# Altium project quads.PrjPCB
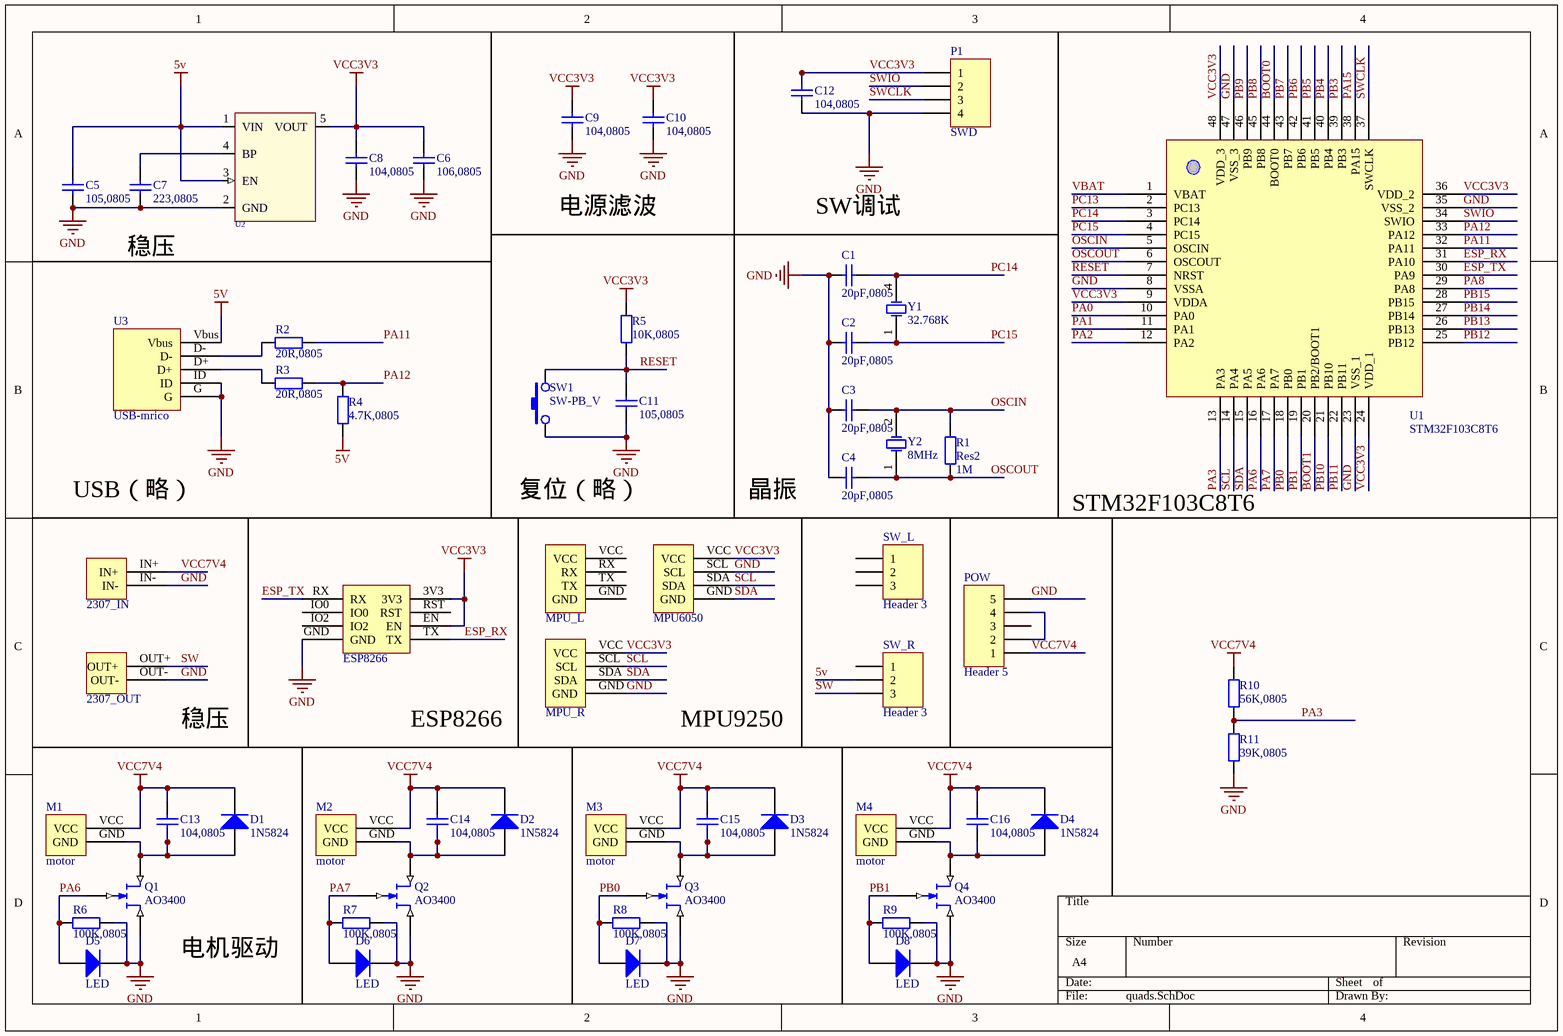
[diagram p0: quads.SchDoc]
1 sheet, 59 parts. Net scope: global (net labels, ports and power ports of the same name join across sheets).
Board file: quads.PcbDoc

## Sheet quads.SchDoc
size A4

### Parts
2307_IN  2307_in  [HDR1X5]  (value not drawn)
2307_OUT  2307_out  [HDR1X5]  (value not drawn)
C1  20pF,0805  [C0805tan]
C2  20pF,0805  [C0805tan]
C3  20pF,0805  [C0805tan]
C4  20pF,0805  [C0805tan]
C5  105,0805  [C0805tan]
C6  106,0805  [C0805tan]
C7  223,0805  [C0805tan]
C8  104,0805  [C0805tan]
C9  104,0805  [C0805tan]
C10  104,0805  [C0805tan]
C11  105,0805  [C0805tan]
C12  104,0805  [C0805tan]
C13  104,0805  [C0805tan]
C14  104,0805  [C0805tan]
C15  104,0805  [C0805tan]
C16  104,0805  [C0805tan]
D1  1N5824  [SMB]
D2  1N5824  [SMB]
D3  1N5824  [SMB]
D4  1N5824  [SMB]
D5  LED  [C0805]
D6  LED  [C0805]
D7  LED  [C0805]
D8  LED  [C0805]
ESP8266  ESP8266  [HDR2X4]  (value not drawn)
M1  motor  [HDR1X2]
M2  motor  [HDR1X2]
M3  motor  [HDR1X2]
M4  motor  [HDR1X2]
MPU6050  MPU_R  [HDR1X4]  (value not drawn)
MPU_L  MPU_L  [HDR1X4]  (value not drawn)
MPU_R  MPU_R  [HDR1X4]  (value not drawn)
P1  SWD  [HDR1X4]
POW  Header 5  [HDR1X5]
Q1  AO3400  [SOT23_N]
Q2  AO3400  [SOT23_N]
Q3  AO3400  [SOT23_N]
Q4  AO3400  [SOT23_N]
R1  Res2  value 1M  [C0805]
R2  20R,0805  [C0805tan]
R3  20R,0805  [C0805tan]
R4  4.7K,0805  [C0805tan]
R5  10K,0805  [C0805tan]
R6  100K,0805  [C0805tan]
R7  100K,0805  [C0805tan]
R8  100K,0805  [C0805tan]
R9  100K,0805  [C0805tan]
R10  56K,0805  [C0805tan]
R11  39K,0805  [C0805tan]
SW1  SW-PB_V  [KEY-SMT]
SW_L  Header 3  [HDR1X3]
SW_R  Header 3  [HDR1X3]
U1  STM32F103C8T6  [48P]
U2  RT9193  [SOT-23-5]  (value not drawn)
U3  USB-mrico  [Micro_USB]
Y1  32.768K  [MC-306]
Y2  8MHz  [XTAL1]

### Nets
5v: C5.2 R4.1 SW_R.2 U2.1(VIN) U2.3(EN) U3.Vbus
GND: 2307_IN.IN- 2307_OUT.OUT- C1.1 C2.1 C3.1 C4.1 C5.1 C6.1 C7.1 C8.1 C9.1 C10.1 C11.1 C12.1 D5.2(K) D6.2(K) D7.2(K) D8.2(K) ESP8266.GND MPU6050.SCL MPU_R.GND P1.4 POW.5 Q1.3(S) Q2.3(S) Q3.3(S) Q4.3(S) R6.1 R7.1 R8.1 R9.1 R11.1 SW1.1 U1.8(VSSA) U1.23(VSS_1) U1.35(VSS_2) U1.47(VSS_3) U2.2(GND) U3.G U3.ID
VCC3V3: C6.2 C8.2 C9.2 C10.2 C12.2 ESP8266.3V3 ESP8266.EN MPU6050.VCC MPU_R.VCC P1.1 R5.2 U1.9(VDDA) U1.24(VDD_1) U1.36(VDD_2) U1.48(VDD_3) U2.5(VOUT)
VCC7V4: 2307_IN.IN+ C13.1 C14.1 C15.1 C16.1 D1.2(K) D2.2(K) D3.2(K) D4.2(K) M1.VCC M2.VCC M3.VCC M4.VCC POW.1 R10.2
BOOT0: U1.44(BOOT0)
BOOT1: U1.20(PB2/BOOT1)
ESP_RX: ESP8266.TX U1.31(PA10)
ESP_TX: ESP8266.RX U1.30(PA9)
OSCIN: C3.2 R1.2 U1.5(OSCIN) Y2.2(OSC2)
OSCOUT: C4.2 R1.1 U1.6(OSCOUT) Y2.1(OSC1)
PA0: U1.10(PA0)
PA1: U1.11(PA1)
PA2: U1.12(PA2)
PA3: R10.1 R11.2 U1.13(PA3)
PA6: D5.1(A) Q1.2(G) R6.2 U1.16(PA6)
PA7: D6.1(A) Q2.2(G) R7.2 U1.17(PA7)
PA8: U1.29(PA8)
PA11: R2.2 U1.32(PA11)
PA12: R3.2 R4.2 U1.33(PA12)
PA15: U1.38(PA15)
PB0: D7.1(A) Q3.2(G) R8.2 U1.18(PB0)
PB1: D8.1(A) Q4.2(G) R9.2 U1.19(PB1)
PB3: U1.39(PB3)
PB4: U1.40(PB4)
PB5: U1.41(PB5)
PB6: U1.42(PB6)
PB7: U1.43(PB7)
PB8: U1.45(PB8)
PB9: U1.46(PB9)
PB10: U1.21(PB10)
PB11: U1.22(PB11)
PB12: U1.25(PB12)
PB13: U1.26(PB13)
PB14: U1.27(PB14)
PB15: U1.28(PB15)
PC13: U1.2(PC13)
PC14: C1.2 U1.3(PC14) Y1.4(OSC2)
PC15: C2.2 U1.4(PC15) Y1.1(OSC1)
RESET: C11.2 R5.1 SW1.2 U1.7(NRST)
SCL: MPU6050.SDA MPU_R.SCL U1.14(PA4)
SDA: MPU6050.GND MPU_R.SDA U1.15(PA5)
SW: 2307_OUT.OUT+ SW_R.3
SWCLK: P1.3 U1.37(SWCLK)
SWIO: P1.2 U1.34(SWIO)
VBAT: U1.1(VBAT)
NetC7_2: C7.2 U2.4(BP)
NetC13_2: C13.2 D1.1(A) M1.GND Q1.1(D)
NetC14_2: C14.2 D2.1(A) M2.GND Q2.1(D)
NetC15_2: C15.2 D3.1(A) M3.GND Q3.1(D)
NetC16_2: C16.2 D4.1(A) M4.GND Q4.1(D)
NetPOW_2: POW.2 POW.4
NetR2_1: R2.1 U3.D-
NetR3_1: R3.1 U3.D+

Not connected (* = marked no-connect by the designer): ESP8266 IO0 IO2 RST; MPU_L GND RX TX VCC; POW 3; SW_L 1 2 3; SW_R 1

### Notes on the sheet
- 电源滤波
- SW调试
- (near C7) 稳压
- USB（略）
- 复位（略）
- 晶振
- STM32F103C8T6
- 稳压
- ESP8266
- MPU9250
- (near Q1) 电机驱动

### Library data of the parts
2307_IN = 2307_in: pin to pad: IN+>1 IN->5
2307_OUT = 2307_out: pin to pad: OUT+>1 OUT->5
C1-C16 = Cap: Capacitor; Value: 104; Published: 8-Jun-2000; LatestRevisionDate: 17-Jul-2002; LatestRevisionNote: Re-released for DXP Platform.; Publisher: Altium Limited
D1-D8 = Diode: Default Diode; Published: 8-Jun-2000; LatestRevisionDate: 17-Jul-2002; LatestRevisionNote: Re-released for DXP Platform.; PackageVersion: Sep-1996; PackageReference: SMC; Publisher: Altium Limited; PackageDescription: DO-214-AB/SMC; 2 C-Bend Leads; Body 7.9 x 5.9 mm, inc. leads (LxW); Code_JEDEC: DO-214-AB
ESP8266 = ESP8266: pin to pad: 3V3>7 EN>3 GND>2 IO0>6 IO2>4 RST>5 RX>8 TX>1
M1-M4 = motor: pin to pad: GND>2 VCC>1
MPU6050 MPU_R = MPU_R: pin to pad: GND>4 SCL>2 SDA>3 VCC>1
MPU_L = MPU_L: pin to pad: GND>4 RX>2 TX>3 VCC>1
P1 = Header 4: Header, 4-Pin; LatestRevisionDate: 17-Jul-2002; LatestRevisionNote: Re-released for DXP Platform.; Publisher: Altium Limited
POW = Header 5: Header, 5-Pin; LatestRevisionDate: 17-Jul-2002; LatestRevisionNote: Re-released for DXP Platform.; Publisher: Altium Limited
Q1-Q4 = MESFET-N: N-Channel MESFET; Published: 8-Jun-2000; LatestRevisionDate: 17-Jul-2002; LatestRevisionNote: Re-released for DXP Platform.; PackageReference: TO-18; Publisher: Altium Limited; PackageDescription: Can; 3 Leads; Pin Circle Dia. 2.54 mm; Lead Dia. 0.48 mm (max); Code_JEDEC: TO-18
R1-R11 = Res2: Resistor; Published: 8-Jun-2000; LatestRevisionDate: 17-Jul-2002; LatestRevisionNote: Re-released for DXP Platform.; Publisher: Altium Limited
  R1: PackageReference: AXIAL-0.4; PackageDescription: Axial Device, Thru-Hole; 2 Leads; 0.4 in Pin Spacing
SW1 = SW-PB_V: SWITCH
SW_L SW_R = Header 3: Header, 3-Pin; LatestRevisionDate: 17-Jul-2002; LatestRevisionNote: Re-released for DXP Platform.; Publisher: Altium Limited
U2 = RT9193X_5P: ICA_MFR_NAME: RICHTEK; ICA_PARTNUM: $$2191094$$RT9193-15CU5; Part Number: TMP-13
U3 = usb-STM: pin to pad: D+>3 D->2 G>5 ID>4 Vbus>1
Y1 = XTAL: Crystal Oscillator; pin to pad: 4>2; Published: 8-Jun-2000; LatestRevisionDate: 17-Jul-2002; LatestRevisionNote: Re-released for DXP Platform.; Publisher: Altium Limited
Y2 = XTAL: Crystal Oscillator; Published: 8-Jun-2000; LatestRevisionDate: 17-Jul-2002; LatestRevisionNote: Re-released for DXP Platform.; Publisher: Altium Limited